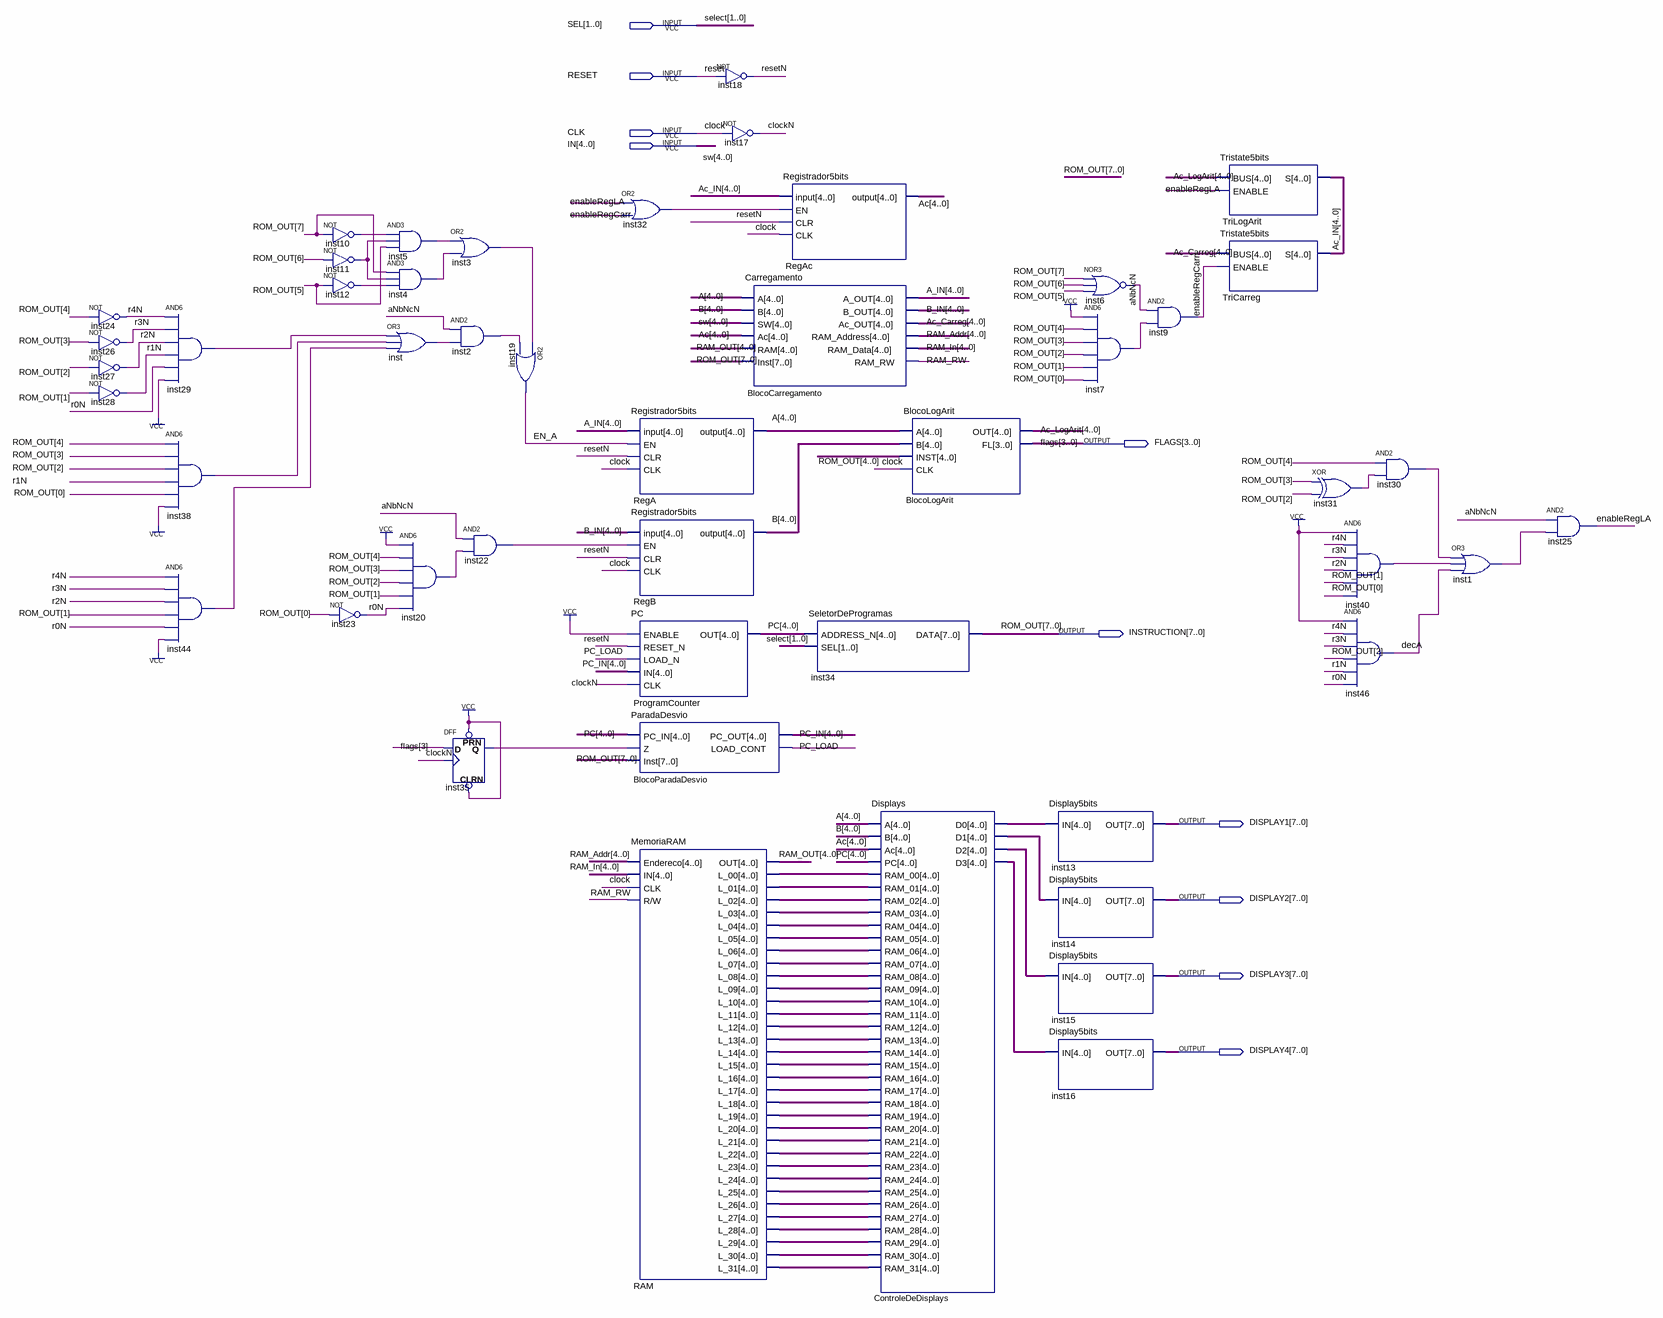
[diagram p0: schematic sheet]
// Quartus schematic Microprocessador5bits.bdf as structural Verilog: 48 symbols, 10 pins
module Microprocessador5bits (
  input  [1:0] SEL,
  input  RESET,
  input  CLK,
  input  [4:0] IN,
  output [3:0] FLAGS,
  output [7:0] INSTRUCTION,
  output [7:0] DISPLAY1,
  output [7:0] DISPLAY2,
  output [7:0] DISPLAY3,
  output [7:0] DISPLAY4
);

  wire aNbNcN, clockN, decA, EN_A, enableRegCarr, enableRegLA, inst1_out, inst2_out, inst3_out, inst4_out,
       inst5_out, inst7_out, inst10_out, inst11_out, inst12_out, inst20_out, inst22_out, inst29_out,
       inst30_out, inst31_out, inst32_out, inst35_q, inst38_out, inst40_out, inst44_out, inst_out, PC_LOAD,
       r0N, r1N, r2N, r3N, r4N, RAM_RW, resetN;
  wire [4:0] A, A_IN, Ac, Ac_Carreg, Ac_IN, Ac_LogArit, B, B_IN, ControleDeDisplays_d0,
       ControleDeDisplays_d1, ControleDeDisplays_d2, ControleDeDisplays_d3, PC, PC_IN, RAM_Addr, RAM_In,
       RAM_l_00, RAM_l_01, RAM_l_02, RAM_l_03, RAM_l_04, RAM_l_05, RAM_l_06, RAM_l_07, RAM_l_08, RAM_l_09,
       RAM_l_10, RAM_l_11, RAM_l_12, RAM_l_13, RAM_l_14, RAM_l_15, RAM_l_16, RAM_l_17, RAM_l_18, RAM_l_19,
       RAM_l_20, RAM_l_21, RAM_l_22, RAM_l_23, RAM_l_24, RAM_l_25, RAM_l_26, RAM_l_27, RAM_l_28, RAM_l_29,
       RAM_l_30, RAM_l_31, RAM_OUT;

  not inst24 (r4N, INSTRUCTION[4]);
  not inst26 (r3N, INSTRUCTION[3]);
  not inst27 (r2N, INSTRUCTION[2]);
  not inst28 (r1N, INSTRUCTION[1]);
  and inst29 (inst29_out, r4N, r3N, r2N, r1N, r0N, 1'b1);
  and inst38 (inst38_out, INSTRUCTION[4], INSTRUCTION[3], INSTRUCTION[2], r1N, INSTRUCTION[0], 1'b1);
  and inst44 (inst44_out, r4N, r3N, r2N, INSTRUCTION[1], r0N, 1'b1);
  not inst10 (inst10_out, INSTRUCTION[7]);
  not inst11 (inst11_out, INSTRUCTION[6]);
  not inst12 (inst12_out, INSTRUCTION[5]);
  not inst23 (r0N, INSTRUCTION[0]);
  and inst5 (inst5_out, inst10_out, inst11_out, INSTRUCTION[5]);
  and inst4 (inst4_out, INSTRUCTION[7], inst11_out, inst12_out);
  or inst (inst_out, inst29_out, inst38_out, inst44_out);
  and inst20 (inst20_out, 1'b1, INSTRUCTION[4], INSTRUCTION[3], INSTRUCTION[2], INSTRUCTION[1], r0N);
  or inst3 (inst3_out, inst5_out, inst4_out);
  and inst2 (inst2_out, aNbNcN, inst_out);
  DFF inst35 (.CLRN(1'b1), .CLK(clockN), .D(FLAGS[3]), .PRN(1'b1), .Q(inst35_q));
  and inst22 (inst22_out, aNbNcN, inst20_out);
  or inst19 (EN_A, inst3_out, inst2_out);
  or inst32 (inst32_out, enableRegLA, enableRegCarr);
  Registrador5bits RegA (.\input (A_IN), .EN(EN_A), .CLR(resetN), .CLK(CLK), .\output (A));
  Registrador5bits RegB (.\input (B_IN), .EN(inst22_out), .CLR(resetN), .CLK(CLK), .\output (B));
  PC ProgramCounter (.ENABLE(1'b1), .RESET_N(resetN), .LOAD_N(PC_LOAD), .IN(PC_IN), .CLK(clockN), .OUT(PC));
  ParadaDesvio BlocoParadaDesvio (.PC_IN(PC), .Z(inst35_q), .Inst(INSTRUCTION), .PC_OUT(PC_IN), .LOAD_CONT(PC_LOAD));
  MemoriaRAM RAM (
    .Endereco(RAM_Addr), .IN(RAM_In), .CLK(CLK), .\R/W (RAM_RW), .OUT(RAM_OUT), .L_00(RAM_l_00),
    .L_01(RAM_l_01), .L_02(RAM_l_02), .L_03(RAM_l_03), .L_04(RAM_l_04), .L_05(RAM_l_05), .L_06(RAM_l_06),
    .L_07(RAM_l_07), .L_08(RAM_l_08), .L_09(RAM_l_09), .L_10(RAM_l_10), .L_11(RAM_l_11), .L_12(RAM_l_12),
    .L_13(RAM_l_13), .L_14(RAM_l_14), .L_15(RAM_l_15), .L_16(RAM_l_16), .L_17(RAM_l_17), .L_18(RAM_l_18),
    .L_19(RAM_l_19), .L_20(RAM_l_20), .L_21(RAM_l_21), .L_22(RAM_l_22), .L_23(RAM_l_23), .L_24(RAM_l_24),
    .L_25(RAM_l_25), .L_26(RAM_l_26), .L_27(RAM_l_27), .L_28(RAM_l_28), .L_29(RAM_l_29), .L_30(RAM_l_30),
    .L_31(RAM_l_31));
  not inst18 (resetN, RESET);
  not inst17 (clockN, CLK);
  Carregamento BlocoCarregamento (
    .A(A), .B(B), .SW(IN), .Ac(Ac), .RAM(RAM_OUT), .Inst(INSTRUCTION), .A_OUT(A_IN), .B_OUT(B_IN),
    .Ac_OUT(Ac_Carreg), .RAM_Address(RAM_Addr), .RAM_Data(RAM_In), .RAM_RW(RAM_RW));
  Registrador5bits RegAc (.\input (Ac_IN), .EN(inst32_out), .CLR(resetN), .CLK(CLK), .\output (Ac));
  SeletorDeProgramas inst34 (.ADDRESS_N(PC), .SEL(SEL), .DATA(INSTRUCTION));
  BlocoLogArit BlocoLogArit (.A(A), .B(B), .INST(INSTRUCTION[4:0]), .CLK(CLK), .OUT(Ac_LogArit), .FL(FLAGS));
  Displays ControleDeDisplays (
    .A(A), .B(B), .Ac(Ac), .PC(PC), .RAM_00(RAM_l_00), .RAM_01(RAM_l_01), .RAM_02(RAM_l_02),
    .RAM_03(RAM_l_03), .RAM_04(RAM_l_04), .RAM_05(RAM_l_05), .RAM_06(RAM_l_06), .RAM_07(RAM_l_07),
    .RAM_08(RAM_l_08), .RAM_09(RAM_l_09), .RAM_10(RAM_l_10), .RAM_11(RAM_l_11), .RAM_12(RAM_l_12),
    .RAM_13(RAM_l_13), .RAM_14(RAM_l_14), .RAM_15(RAM_l_15), .RAM_16(RAM_l_16), .RAM_17(RAM_l_17),
    .RAM_18(RAM_l_18), .RAM_19(RAM_l_19), .RAM_20(RAM_l_20), .RAM_21(RAM_l_21), .RAM_22(RAM_l_22),
    .RAM_23(RAM_l_23), .RAM_24(RAM_l_24), .RAM_25(RAM_l_25), .RAM_26(RAM_l_26), .RAM_27(RAM_l_27),
    .RAM_28(RAM_l_28), .RAM_29(RAM_l_29), .RAM_30(RAM_l_30), .RAM_31(RAM_l_31), .D0(ControleDeDisplays_d0),
    .D1(ControleDeDisplays_d1), .D2(ControleDeDisplays_d2), .D3(ControleDeDisplays_d3));
  Display5bits inst13 (.IN(ControleDeDisplays_d0), .OUT(DISPLAY1));
  Display5bits inst14 (.IN(ControleDeDisplays_d1), .OUT(DISPLAY2));
  Display5bits inst15 (.IN(ControleDeDisplays_d2), .OUT(DISPLAY3));
  Display5bits inst16 (.IN(ControleDeDisplays_d3), .OUT(DISPLAY4));
  nor inst6 (aNbNcN, INSTRUCTION[7], INSTRUCTION[6], INSTRUCTION[5]);
  and inst7 (inst7_out, 1'b1, INSTRUCTION[4], INSTRUCTION[3], INSTRUCTION[2], INSTRUCTION[1], INSTRUCTION[0]);
  and inst9 (enableRegCarr, aNbNcN, inst7_out);
  Tristate5bits TriLogArit (.BUS(Ac_LogArit), .ENABLE(enableRegLA), .S(Ac_IN));
  Tristate5bits TriCarreg (.BUS(Ac_Carreg), .ENABLE(enableRegCarr), .S(Ac_IN));
  xor inst31 (inst31_out, INSTRUCTION[3], INSTRUCTION[2]);
  and inst40 (inst40_out, 1'b1, r4N, r3N, r2N, INSTRUCTION[1], INSTRUCTION[0]);
  and inst46 (decA, 1'b1, r4N, r3N, INSTRUCTION[2], r1N, r0N);
  and inst30 (inst30_out, INSTRUCTION[4], inst31_out);
  or inst1 (inst1_out, inst30_out, inst40_out, decA);
  and inst25 (enableRegLA, aNbNcN, inst1_out);

  // Other names for the same wires on the sheet: clock = CLK; ROM_OUT[7:0] = INSTRUCTION; select[1:0] = SEL;
  //   sw[4:0] = IN
endmodule
